# Altium project smol.PrjPcb
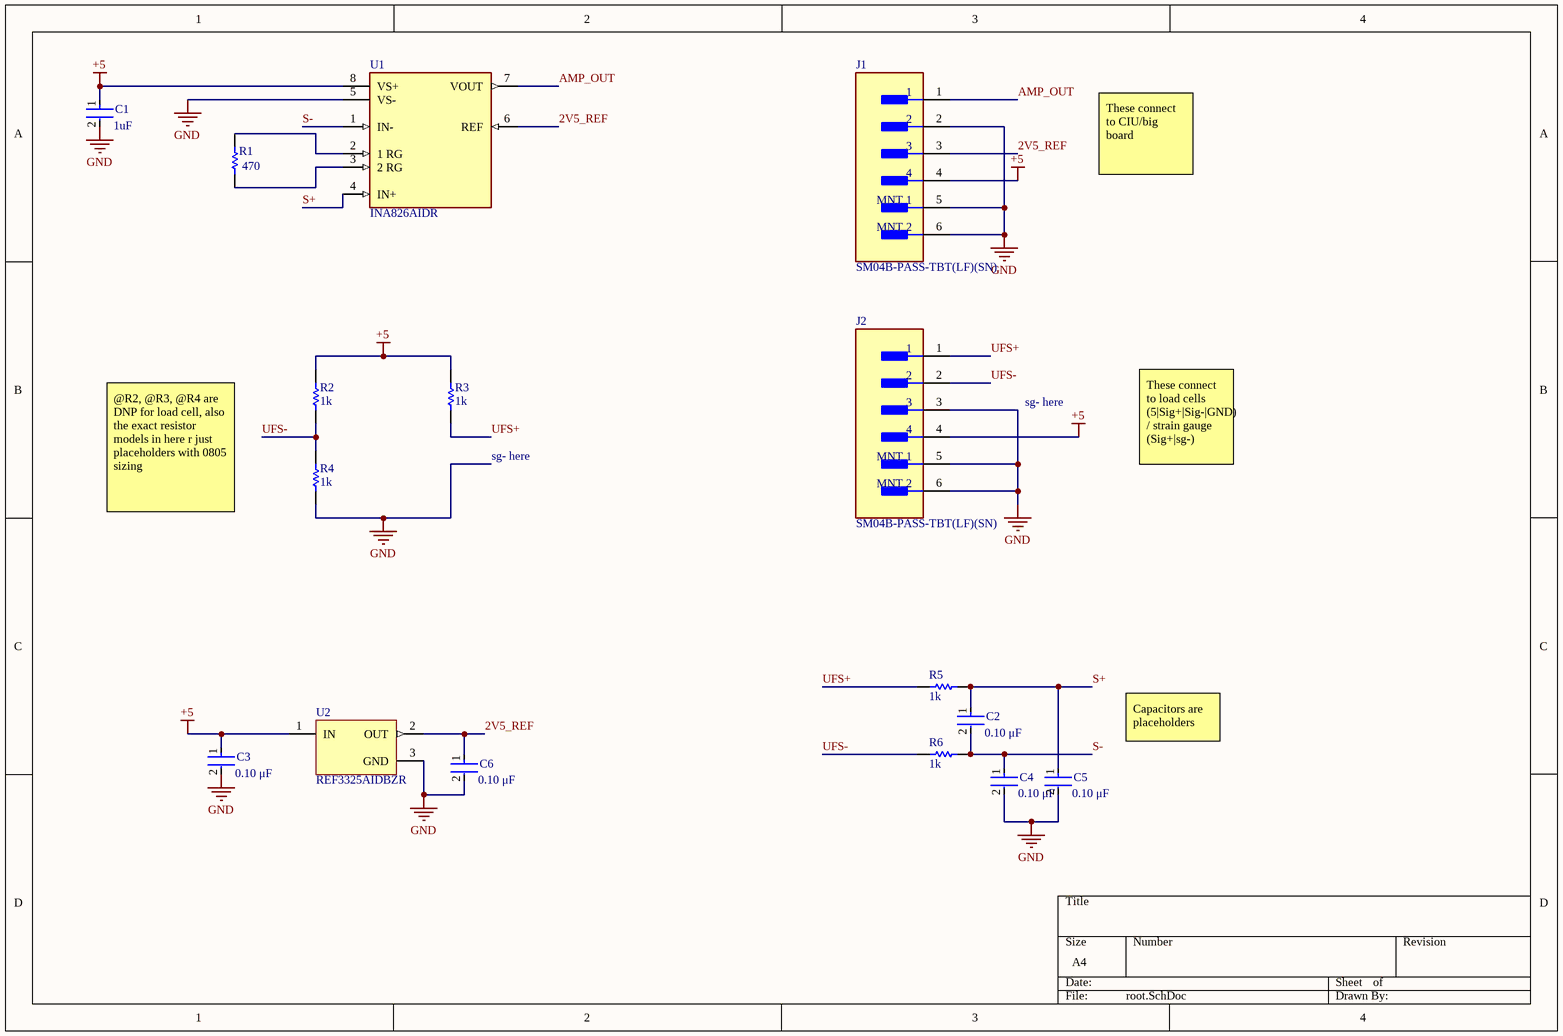
[diagram p0: root.SchDoc]
1 sheet, 16 parts. Net scope: global (net labels, ports and power ports of the same name join across sheets).
Board file: smol.PcbDoc

## Sheet root.SchDoc
size A4; SheetNumber: 1; SheetTotal: 1

### Parts
C1  Capacitance: 1uF  [FP-CL21-IPC_B]  (hidden comment: CL21B105KBFNNNG)
C2  value 0.10 μF  [FP-C0805C-DN-IPC_B]  (hidden comment: C0805C104K5RACTU)
C3  value 0.10 μF  [FP-C0805C-DN-IPC_B]  (hidden comment: C0805C104K5RACTU)
C4  value 0.10 μF  [FP-C0805C-DN-IPC_B]  (hidden comment: C0805C104K5RACTU)
C5  value 0.10 μF  [FP-C0805C-DN-IPC_B]  (hidden comment: C0805C104K5RACTU)
C6  value 0.10 μF  [FP-C0805C-DN-IPC_B]  (hidden comment: C0805C104K5RACTU)
J1  SM04B-PASS-TBT(LF)(SN)  [FP-SM04B-PASS-TBT_LF_SN-MFG]
J2  SM04B-PASS-TBT(LF)(SN)  [FP-SM04B-PASS-TBT_LF_SN-MFG]
R1  Resistance: 470  [RESC2013X60X35NL10T20]  (hidden comment: RC0805FR-07470RL)
R2  1k  [RESC2013X60X35NL10T20]
R3  1k  [RESC2013X60X35NL10T20]
R4  1k  [RESC2013X60X35NL10T20]
R5  1k  [RESC2013X60X35NL10T20]
R6  1k  [RESC2013X60X35NL10T20]
U1  INA826AIDR  [FP-D0008A-IPC_A]
U2  REF3325AIDBZR  [DBZ0003A_N]

### Nets
+5: C1.1 C3.1 J1.4 J2.4 R2.2 R3.2 U1.8(VS+) U2.1(IN)
GND: C1.2 C3.2 C4.2 C5.2 C6.2 J1.2 J1.5(MNT_1) J1.6(MNT_2) J2.3 J2.5(MNT_1) J2.6(MNT_2) R4.1 U1.5(VS-) U2.3(GND)
2V5_REF: C6.1 J1.3 U1.6(REF) U2.2(OUT)
AMP_OUT: J1.1 U1.7(VOUT)
S+: C2.1 C5.1 R5.2 U1.4(IN+)
S-: C2.2 C4.1 R6.2 U1.1(IN-)
UFS+: J2.1 R3.1 R5.1
UFS-: J2.2 R2.1 R4.2 R6.1
NetR1_1: R1.1 U1.3(2_RG)
NetR1_2: R1.2 U1.2(1_RG)

### Notes on the sheet
- These connect to CIU/big board
- sg- here
- @R2, @R3, @R4 are DNP for load cell, also the exact resistor models in here r just placeholders with 0805 sizing
- These connect to load cells (5|Sig+|Sig-|GND) / strain gauge (Sig+|sg-)
- Capacitors are placeholders

### Library data of the parts
C1 = CMP-13271-001433-1: CL21 Series 0805 1uF 50V ±10% Tolerance X7R Multilayer Ceramic Chip Capacitor; Case Code (Metric): 2012; Max Operating Temperature: 125°C; Termination: Wraparound; Voltage: 50V; Min Operating Temperature: -55°C; Packaging: Tape and Reel; Contact Plating: Tin; Case/Package: 0805; Depth: 1.25mm; Case Code (Imperial): 0805; Mount: Surface Mount; Material: Ceramic; Tolerance: 10%; Thickness: 0.053inch; Package Quantity: 3000; Voltage Rating: 50V; Width: 0.049inch; Length: 2mm; Dielectric: X7R
C2-C6 = CMP-2007-00279-2: CAP CER 0.1UF 50V X7R 0805; Manufacturer: KEMET; Tolerance: 0.1; Temperature Coefficient: 30ppm/°C; Material: Ceramic; Manufacturer Part Number: C0805C104K5RACTU; Device Class L2: Capacitors; Temperature Range Low: -55°C; Voltage Rating: 50 V; Digikey Description: CAP CER 0.1UF 50V X7R 0805; Category: Cap; ComponentLink2Description: Datasheet; Octopart: https://octopart.com/c0805c104k5ractu-kemet-143926; RoHS: TRUE; ComponentLink2URL: https://content.kemet.com/datasheets/KEM_C1003_C0G_SMD.pdf; Temperature Characteristic: X7R; Temperature: -55°C to +125°C; Height: 0.88mm; Temperature Range High: +125°C; Device Class L1: Passive Components; Automotive: No; Lead Free: Yes; Ipc Land Pattern Name: CAPC200125X78; Device Class L3: Ceramic Capacitors; Mouser Description: Cap Ceramic 0.1uF 50V X7R 10% SMD 2.0 x 1.2 mm 125 C Paper T/R; Capacitance: 0.10 μF; Package: C0805C-DN
J1 J2 = CMP-2000-07078-2: CONN HEADER SMD R/A 4POS 2MM; Manufacturer: JST; Voltage Rating: 250V; Current Rating: 3A; Conn Gender: Male; Conn Orientation: Right Angle; Number Of Contacts: 4; Height: 5.7mm; Contact Material: Tin; Device Class L2: Headers and Wire Housings; Number Of Rows: 1; Device Class L1: Connectors; RoHS: TRUE; Lead Free: Yes; Automotive: No; Digikey Description: CONN HEADER SMD R/A 4POS 2MM; Manufacturer Part Number: SM04B-PASS-TBT(LF)(SN); Temperature: -25°C to +85°C; Package: SM04B-PASS-TBT(LF)(SN); Temperature Range Low: -25°C; ComponentLink2Description: Datasheet; Temperature Range High: +85°C; Pitch: 2mm; ComponentLink2URL: http://www.jst-mfg.com/product/pdf/eng/ePA-F.pdf; Octopart: https://octopart.com/sm04b-pass-tbt%28lf%29%28sn%29-jst-3990422; Category: Conn; Device Class L3: unset
R1 = CMP-2000-06961-1: Chip Resistor, 470 Ohm, +/- 1%, 125 mW, -55 to 155 degC, 0805 (2012 Metric), RoHS, Tape and Reel; Manufacturer: Yageo; Power Rating: 250mW; Resistor Case Style: 0805[2012Metric]; Voltage Rating: 150V; Resistor Element Type: ThickFilm; Temperature Coefficient: ±100ppm/°C; SVHC: ToBeAdvised; Datasheet Version: Rev. 7, 05/2017; Automotive Qualification Standard: -; Mounting Technology: SurfaceMount; Product Range: -; Packaging: Tape&Reel; Package Description: 2-Pin Surface Mounted Device, Body 2 x 1.25 mm; MSL: MSL1-Unlimited; Package Reference: 0805; Resistance Tolerance: ±1%; Datasheet URL: http://www.yageo.com/documents/recent/PYu-RC_Group_51_RoHS_L_7.pdf; Manufacturer URL: http://www.yageo.com/
R2-R6 = CMP-2001-04511-1: Part Number: AC0805JR-071KL; Manufacturer: Yageo
U1 = CMP-0944-00042-3: IC INST AMP 1 CIRCUIT 8SOIC; Number of Circuits: 1; Common Mode Rejection Ratio: 84dB; Power Supply Rejection Ratio (PSRR): 100dB; Input Voltage Noise Density: 18nV/sqrt Hz; Input Resistance: 100kR; Output Current per Channel: 16mA; Input Offset Voltage (Vos): 150uV; Bandwidth: 1MHz; Supply Current: 200uA; Input Bias Current: 65nA; Max Dual Supply Voltage: 18V; Max Supply Voltage: 36V; Min Supply Voltage: 2.7V; Voltage Gain: 60dB; Slew Rate: 1V/µs; Min Dual Supply Voltage: 1.35V; Number of Elements: 1; Series: -; Number of Pins: 8; Lead Free: Lead Free; Output Current: 16mA; REACH SVHC: No SVHC; Min Operating Temperature: -40°C; Quiescent Current: 200uA; Nominal Supply Current: 200uA; Max Operating Temperature: 125°C; RoHS Compliant: Yes; Case/Package: D; -3db Bandwidth: 1MHz; Radiation Hardening: No; Operating Supply Current: 200uA; Packaging: Tape and Reel; Package Quantity: 1; Number of Amplifiers: 1; Number of Channels: 1
U2 = CMP-0367-00131-2: 30 ppm / degC Drift, 3.9 uA Voltage Reference, -40 to 125 degC, 3-pin SOT-23 (DBZ), Green (RoHS & no Sb/Br); Manufacturer: Texas Instruments; Temp Coeff(Max)(ppm/ degree C): 30; Initial Accuracy @ 25/deg C(%): 0.15; Rating: Catalog; VI(Max)(V): 5.5; Iout/Iz(Max)(mA): 5; VO(V): 2.5; VI(Min)(V): 2.66; SubFamily: Series Voltage Reference; Temp Coeff(Typ)(ppm/ degree C): 8; ComponentLink1Description: Manufacturer URL; PackageReference: DBZ0003A; ComponentLink3Description: Package Specification; PartNumber: REF3325AIDBZR; PackageVersion: 4203227/B; DatasheetVersion: SBOS392A; PackageDescription: 3-Pin Plastic Small Outline, Body 2.92 x 1.3 mm, Pitch 0.95 mm; Eco-Plan: Green (RoHS & no Sb/Br); ComponentLink2Description: Datasheet; ComponentLink3URL: http://www.ti.com/litv/pdf/mpds108a; ComponentLink2URL: http://www.ti.com/general/docs/lit/getliterature.tsp?genericPartNumber=REF3325&fileType=pdf; Iq(Max)(uA): 5; Mounting Technology: Surface Mount; ComponentLink1URL: http://www.ti.com/; Code_JEDEC: TO-236